# EAGLE design Thermocouple_Amplifier_K_v1p1 (EAGLE 9.6.2)
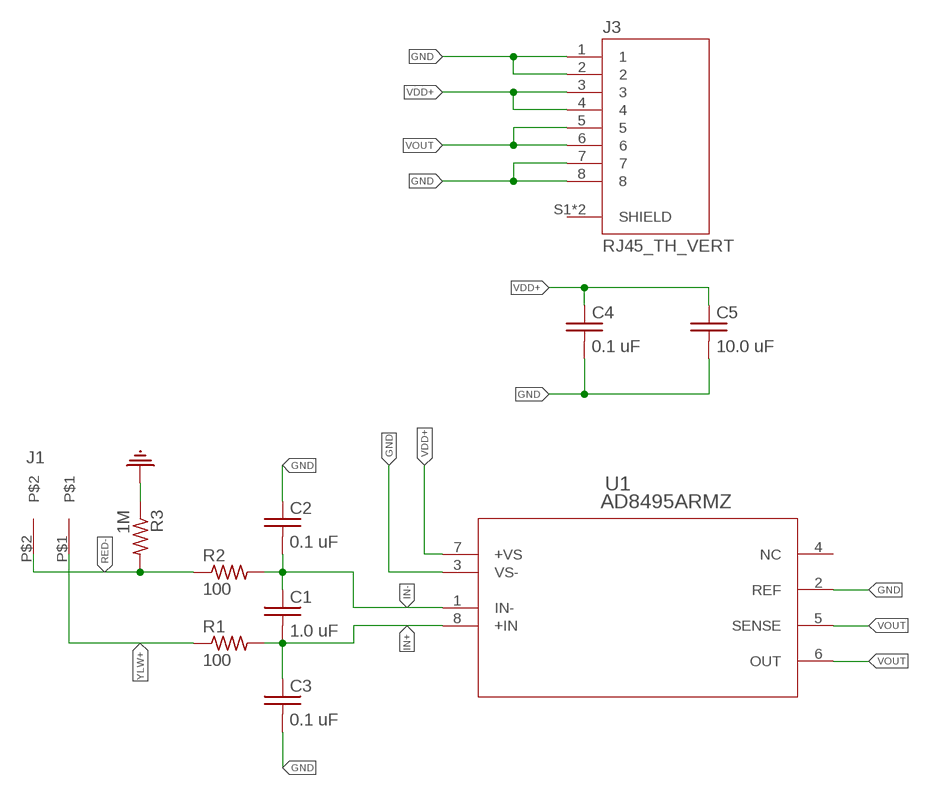
[diagram p0: schematic, sheet 1]

## Parts
C1  1.0 uF  C_0402  [0402]
C2  0.1 uF  C_0402  [0402]
C3  0.1 uF  C_0402  [0402]
C4  0.1 uF  C_0402  [0402]
C5  10.0 uF  C_0402  [0402]
J1  3.81MM_1_X_2_RT_ANGLE_PLUG_HEADER  [2_3.81MM_PITCH]
J3  RJ45_TH_VERT  [ASSMANN_A-2014-2S-4-N-R]
R1  100  R_0402  [0402]
R2  100  R_0402  [0402]
R3  1M  R_0402  [0402]
U1  AD8495ARMZ  [RM_8_ADI]

## Nets
GND: C2.P$1 C3.P$2 C4.P$2 C5.P$2 J3.1 J3.2 J3.7 J3.8 R3.P$1 U1.2(REF) U1.3(VS-)
IN+: C1.P$2 C3.P$1 R1.P$2 U1.8(+IN)
IN-: C1.P$1 C2.P$2 R2.P$2 U1.1(IN-)
RED-: J1.P$2 R2.P$1 R3.P$2
VDD+: C4.P$1 C5.P$1 J3.3 J3.4 U1.7(+VS)
VOUT: J3.5 J3.6 U1.5(SENSE) U1.6(OUT)
YLW+: J1.P$1 R1.P$1
Unconnected: J3.S1(SHIELD) J3.S2(SHIELD) U1.4(NC)

## Library data of the parts
C1-C5 = 3D_MIG_Controller:C_0402
J1 = 3D_MIG_Controller:3.81MM_1_X_2_RT_ANGLE_PLUG_HEADER
J3 = 3D_MIG_Controller:RJ45_TH_VERT: Jack Modular Connector 8p8c (RJ45, Ethernet) Vertical Shielded; DESCRIPTION: Jack Modular Connector 8p8c (RJ45, Ethernet) Vertical Shielded; DIGI-KEY_PART_NUMBER: AE10399-ND; MF: Assmann WSW Components; MP: A-2014-2S-4-N-R; PACKAGE: None
R1-R3 = 3D_MIG_Controller:R_0402
U1 = 3D_MIG_Controller:AD8495ARMZ; BUILT_BY: EMA_UL_Team; MANUFACTURER_PART_NUMBER: AD8495ARMZ; SOURCELIBRARY: Analog_2015-12-15; VENDOR: Analog Devices Inc

## Board
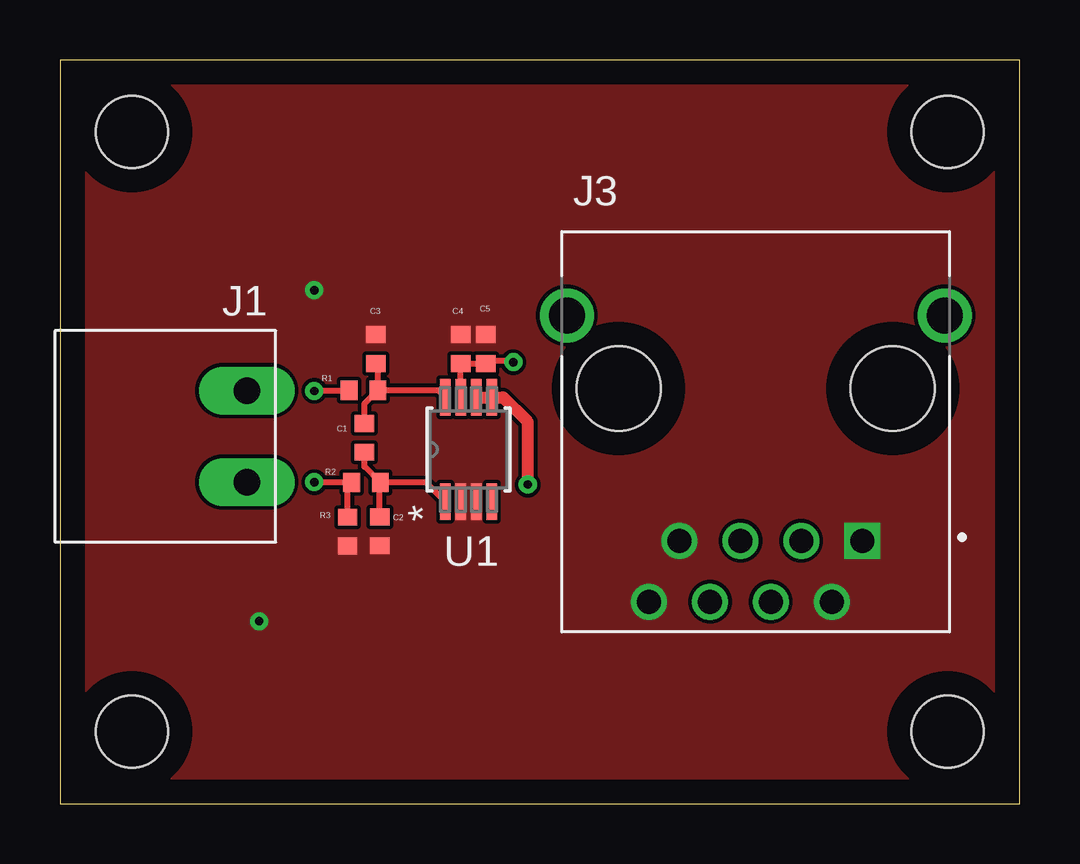
[diagram p1: board, top side]
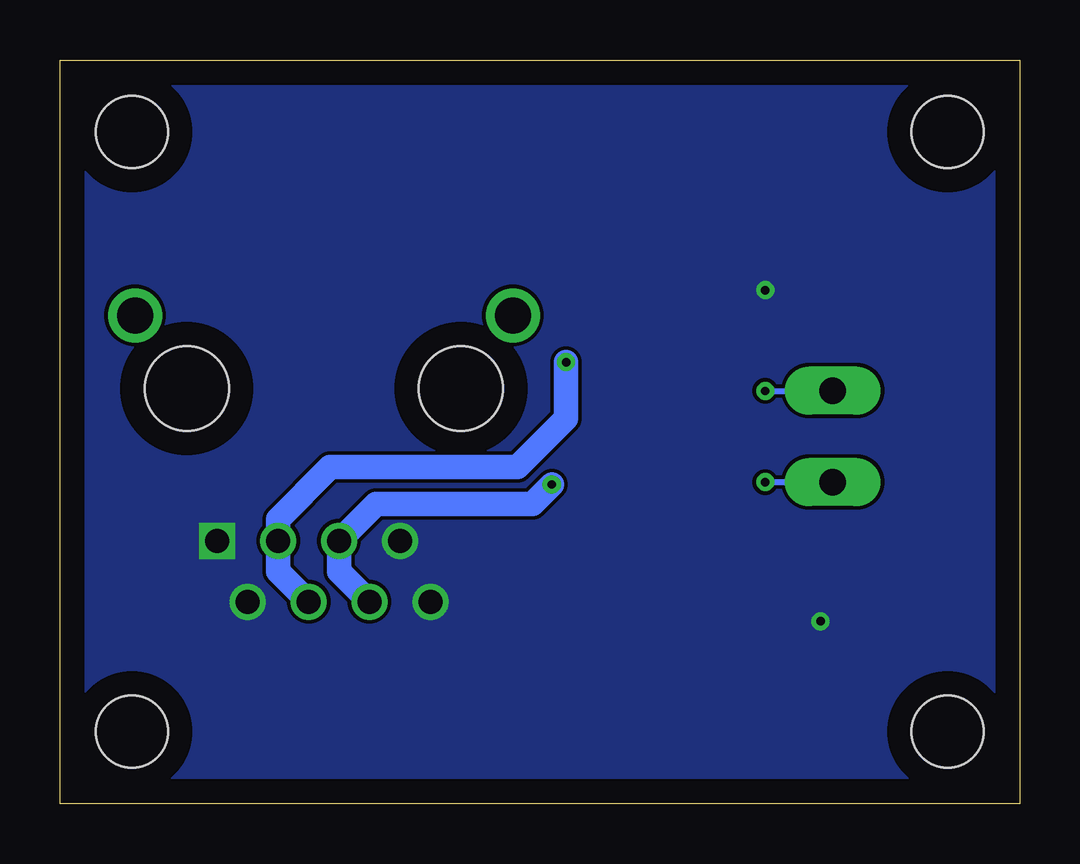
[diagram p2: board, bottom side, seen from below]

Size 40 x 31 mm. Coordinates in mm from the lower left corner, seen from the top.
Outline: 0,0 40,0 40,31 0,31 0,0
Copper layers (1*16): Top 0.035mm / dielectric 1.5mm / Bottom 0.035mm
Design rules "default": minimum track width 6mil, minimum drill 0.35mm, track to track 6mil, track to pad 6mil, pad to pad 6mil, via to via 6mil, smd to smd 6mil, copper to edge 40mil, drill to drill 6mil, minimum pad ring 10mil, minimum via ring 8mil, stop-mask expansion 4mil, vias tented up to drill 0mil, thermal gap 10mil
Holes 3 mm at 3,28 37,28 3,3 37,3

### Footprints (pad centres in the part's own frame; a part is rotated, then mirrored left to right if it is on the bottom)
0402 = smd 0.8 x 0.7: P$1 0,0.6; P$2 0,-0.6
2_3.81MM_PITCH = drill 1.1 pad 2 long: P$1 0,0; P$2 3.81,0
ASSMANN_A-2014-2S-4-N-R = drill 1 square: 1 4.445,-6.35 | drill 1: 2 3.175,-8.89; 3 1.905,-6.35; 4 0.635,-8.89; 5 -0.635,-6.35; 6 -1.905,-8.89; 7 -3.175,-6.35; 8 -4.445,-8.89 | drill 1.5: S1 -7.875,3.05; S2 7.875,3.05 | hole 3.51: -5.715,0; 5.715,0
RM_8_ADI = smd 1.524 x 0.432: 1 -2.172,0.975; 2 -2.172,0.325; 3 -2.172,-0.325; 4 -2.172,-0.975; 5 2.172,-0.975; 6 2.172,-0.325; 7 2.172,0.325; 8 2.172,0.975

### Placement (x,y rotation side)
C1  12.69,15.25 180 top
C2  13.33,11.35 180 top
C3  13.17,18.95 180 top
C4  16.71,18.95 180 top
C5  17.75,18.95 180 top
J1  7.79,17.21 270 top
J3  29,17.3 0 top
R1  12.65,17.23 90 top
R2  12.75,13.39 90 top
R3  11.99,11.34 180 top
U1  17.03,14.76 90 top

### Tracks (layer width: path | path; a pad name or v marks a point on that pad's centre or on a via)
GND  (via drill 0.35)
  other vias: 10.6,21.4 8.3,7.6
  pour Top (no thermals): 40,31 40,0 0,0 0,31
  pour Bottom (no thermals): 0,31 40,31 40,0 0,0
IN+
  Top 0.254: R1.P$2 15.76,17.23 U1.8 | C1.P$2 12.69,16.67 R1.P$2 | R1.P$2 13.25,18.27 C3.P$1
IN-
  Top 0.254: U1.1 15.25,13.39 R2.P$2 | R2.P$2 12.69,14.05 C1.P$1 | C2.P$2 13.33,13.37 R2.P$2
RED-  (via drill 0.35)
  Top 0.254: R3.P$2 11.99,13.23 R2.P$1 v10.61,13.39 v10.6,13.4
  Bottom 0.254: v10.6,13.4 J1.P$2
VDD+  (via drill 0.35)
  Top 0.254: U1.7 C4.P$1 C5.P$1 17.95,18.35 18.05,18.45 18.85,18.45 v18.9,18.4
  Bottom 1.016: J3.4 30.91,9.68 J3.3 30.91,11.85 28.73,14.02 20.93,14.02 18.9,16.05 v18.9,18.4
VOUT  (via drill 0.35)
  Top 0.508: U1.6 U1.5 18.47,16.93 19.5,15.9 v19.5,13.3
  Bottom 1.016: J3.6 28.36,9.68 J3.5 26.82,12.5 20.3,12.5 v19.5,13.3
YLW+  (via drill 0.35)
  Top 0.254: 12.03,17.21 R1.P$1 12.02,17.2 v10.6,17.2
  Bottom 0.254: v10.6,17.2 J1.P$1